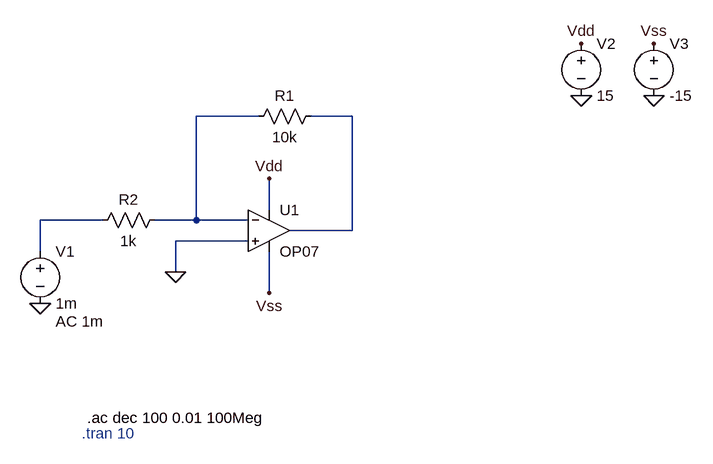
[diagram p0: schematic 1f.asc]
1f.asc, the LTspice schematic file:
Version 4.1
SHEET 1 880 680
WIRE 144 -32 48 -32
WIRE 288 -32 224 -32
WIRE 160 112 160 64
WIRE -96 128 -192 128
WIRE 48 128 48 -32
WIRE 48 128 -16 128
WIRE 128 128 48 128
WIRE 288 144 288 -32
WIRE 288 144 192 144
WIRE 128 160 16 160
WIRE -192 176 -192 128
WIRE 16 208 16 160
WIRE 160 240 160 176
FLAG 640 -64 0
FLAG 752 -64 0
FLAG 640 -144 Vdd
FLAG 752 -144 Vss
FLAG 160 64 Vdd
FLAG 160 240 Vss
FLAG -192 256 0
FLAG 16 208 0
SYMBOL voltage 640 -160 R0
SYMATTR InstName V2
SYMATTR Value 15
SYMBOL voltage 752 -160 R0
SYMATTR InstName V3
SYMATTR Value -15
SYMBOL OpAmps\\OP07 160 80 R0
SYMATTR InstName U1
SYMBOL res 240 -48 R90
WINDOW 0 0 56 VBottom 2
WINDOW 3 32 56 VTop 2
SYMATTR InstName R1
SYMATTR Value 10k
SYMBOL res 0 112 R90
WINDOW 0 0 56 VBottom 2
WINDOW 3 32 56 VTop 2
SYMATTR InstName R2
SYMATTR Value 1k
SYMBOL voltage -192 160 R0
WINDOW 123 24 124 Left 2
WINDOW 39 0 0 Left 0
SYMATTR InstName V1
SYMATTR Value 1m
SYMATTR Value2 AC 1m
TEXT -128 456 Left 2 ;.tran 10
TEXT -120 432 Left 2 !.ac dec 100 0.01 100Meg

The netlist it stands for:
* 1f.asc
V2 Vdd 0 15
V3 Vss 0 -15
X§U1 0 N001 Vdd Vss N002 LT1001  ; OP07, pins In+ In- V+ V- OUT
R1 N002 N001 10k
R2 N001 N003 1k
V1 N003 0 1m AC 1m
* .tran 10
.ac dec 100 0.01 100Meg
.lib LTC.lib
.backanno
.end